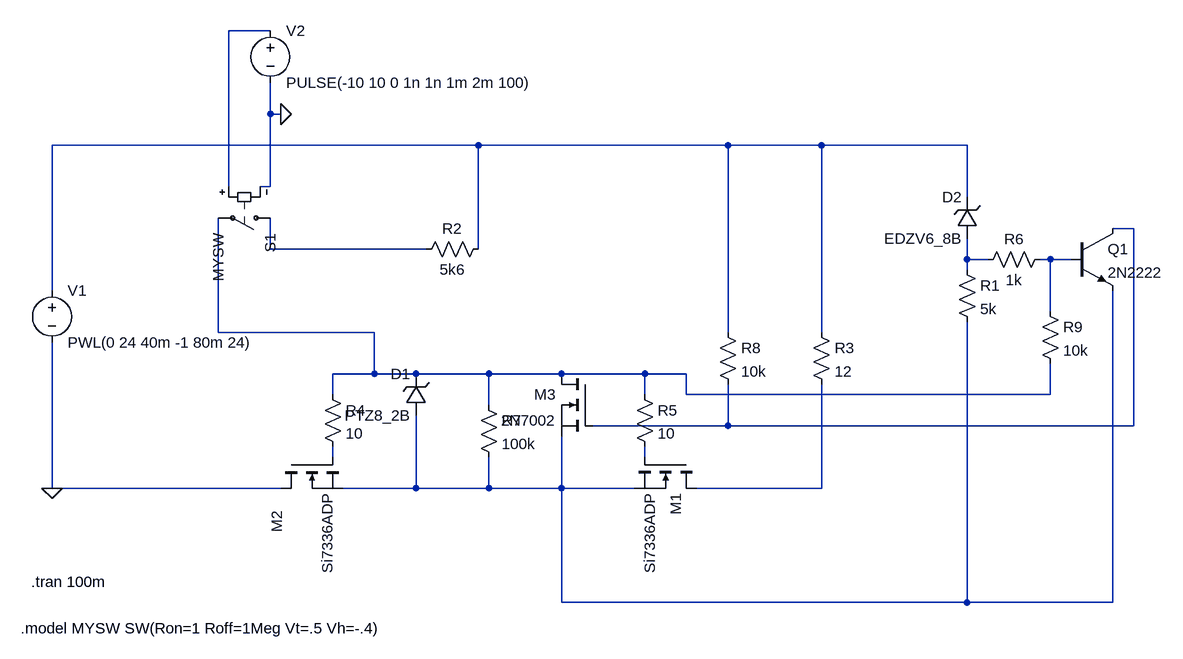
[diagram p0: schematic Rev1.4.asc]
Rev1.4.asc, the LTspice schematic file:
Version 4
SHEET 1 2148 680
WIRE 192 -304 128 -304
WIRE 192 -176 192 -224
WIRE 208 -176 192 -176
WIRE 512 -128 -144 -128
WIRE 896 -128 512 -128
WIRE 1040 -128 896 -128
WIRE 1264 -128 1040 -128
WIRE 128 -64 128 -304
WIRE 192 -64 192 -176
WIRE 192 -64 176 -64
WIRE 1264 -48 1264 -128
WIRE 1520 0 1488 0
WIRE 192 32 192 -16
WIRE 432 32 192 32
WIRE 512 32 512 -128
WIRE 1264 48 1264 16
WIRE 1296 48 1264 48
WIRE 1392 48 1376 48
WIRE 1424 48 1392 48
WIRE 1264 64 1264 48
WIRE -144 96 -144 -128
WIRE 1392 128 1392 48
WIRE 112 160 112 -16
WIRE 352 160 112 160
WIRE 896 160 896 -128
WIRE 1040 160 1040 -128
WIRE 352 224 352 160
WIRE 352 224 288 224
WIRE 416 224 352 224
WIRE 528 224 416 224
WIRE 640 224 528 224
WIRE 768 224 640 224
WIRE 832 224 768 224
WIRE 288 256 288 224
WIRE 768 256 768 224
WIRE 832 256 832 224
WIRE 1392 256 1392 208
WIRE 1392 256 832 256
WIRE 528 272 528 224
WIRE 896 304 896 240
WIRE 896 304 688 304
WIRE 1520 304 1520 0
WIRE 1520 304 896 304
WIRE 288 352 288 336
WIRE 768 352 768 336
WIRE -144 400 -144 176
WIRE 208 400 -144 400
WIRE 416 400 416 288
WIRE 416 400 304 400
WIRE 528 400 528 352
WIRE 528 400 416 400
WIRE 640 400 640 320
WIRE 640 400 528 400
WIRE 752 400 640 400
WIRE 1040 400 1040 240
WIRE 1040 400 848 400
WIRE 640 576 640 400
WIRE 1264 576 1264 144
WIRE 1264 576 640 576
WIRE 1488 576 1488 96
WIRE 1488 576 1264 576
FLAG -144 400 0
FLAG 208 -176 0
SYMBOL nmos 848 352 R90
SYMATTR InstName M1
SYMATTR Value Si7336ADP
SYMBOL nmos 208 352 M90
WINDOW 0 83 -6 Left 2
SYMATTR InstName M2
SYMATTR Value Si7336ADP
SYMBOL voltage -144 80 R0
WINDOW 123 0 0 Left 2
WINDOW 39 0 0 Left 2
SYMATTR InstName V1
SYMATTR Value PWL(0 24 40m -1 80m 24)
SYMBOL res 528 16 R90
WINDOW 0 0 56 VBottom 2
WINDOW 3 32 56 VTop 2
SYMATTR InstName R2
SYMATTR Value 5k6
SYMBOL res 1024 144 R0
SYMATTR InstName R3
SYMATTR Value 12
SYMBOL zener 432 288 R180
WINDOW 0 24 64 Left 2
WINDOW 3 24 0 Left 2
SYMATTR InstName D1
SYMATTR Value PTZ8_2B
SYMBOL sw 208 -16 R90
SYMATTR InstName S1
SYMATTR Value MYSW
SYMATTR SpiceModel MYSW
SYMBOL voltage 192 -320 R0
WINDOW 123 0 0 Left 2
WINDOW 39 0 0 Left 2
SYMATTR InstName V2
SYMATTR Value PULSE(-10 10 0 1n 1n 1m 2m 100)
SYMBOL res 272 240 R0
SYMATTR InstName R4
SYMATTR Value 10
SYMBOL res 752 240 R0
SYMATTR InstName R5
SYMATTR Value 10
SYMBOL res 512 256 R0
SYMATTR InstName R7
SYMATTR Value 100k
SYMBOL zener 1280 16 R180
WINDOW 0 24 64 Left 2
WINDOW 3 24 0 Left 2
SYMATTR InstName D2
SYMATTR Value EDZV6_8B
SYMATTR Description Diode
SYMATTR Type diode
SYMBOL res 1248 48 R0
SYMATTR InstName R1
SYMATTR Value 5k
SYMBOL nmos 688 224 M0
SYMATTR InstName M3
SYMATTR Value 2N7002
SYMBOL npn 1424 0 R0
SYMATTR InstName Q1
SYMATTR Value 2N2222
SYMBOL res 1392 32 R90
WINDOW 0 0 56 VBottom 2
WINDOW 3 32 56 VTop 2
SYMATTR InstName R6
SYMATTR Value 1k
SYMBOL res 880 144 R0
SYMATTR InstName R8
SYMATTR Value 10k
SYMBOL res 1376 112 R0
SYMATTR InstName R9
SYMATTR Value 10k
TEXT -176 544 Left 2 !.tran 100m
TEXT -192 616 Left 2 !.model MYSW SW(Ron=1 Roff=1Meg Vt=.5 Vh=-.4)

The netlist it stands for:
* Rev1.4.asc
M1 N011 N009 N010 N010 Si7336ADP
M2 0 N008 N010 N010 Si7336ADP
V1 N002 0 PWL(0 24 40m -1 80m 24)
R2 N002 N004 5k6
R3 N002 N011 12
D1 N010 N007 PTZ8_2B
S1 N004 N007 N001 0 MYSW MYSW
V2 N001 0 PULSE(-10 10 0 1n 1n 1m 2m 100)
R4 N007 N008 10
R5 N007 N009 10
R7 N007 N010 100k
D2 N005 N002 EDZV6_8B
R1 N005 N010 5k
M3 N007 N003 N010 N010 2N7002
Q1 N003 N006 N010 0 2N2222
R6 N006 N005 1k
R8 N002 N003 10k
R9 N006 N007 10k
.model D D
.lib standard.dio
.model NPN NPN
.model PNP PNP
.lib standard.bjt
.model NMOS NMOS
.model PMOS PMOS
.lib standard.mos
.tran 100m
.model MYSW SW(Ron=1 Roff=1Meg Vt=.5 Vh=-.4)
.backanno
.end